# Altium schematic sheet 电路图.SchDoc
size A
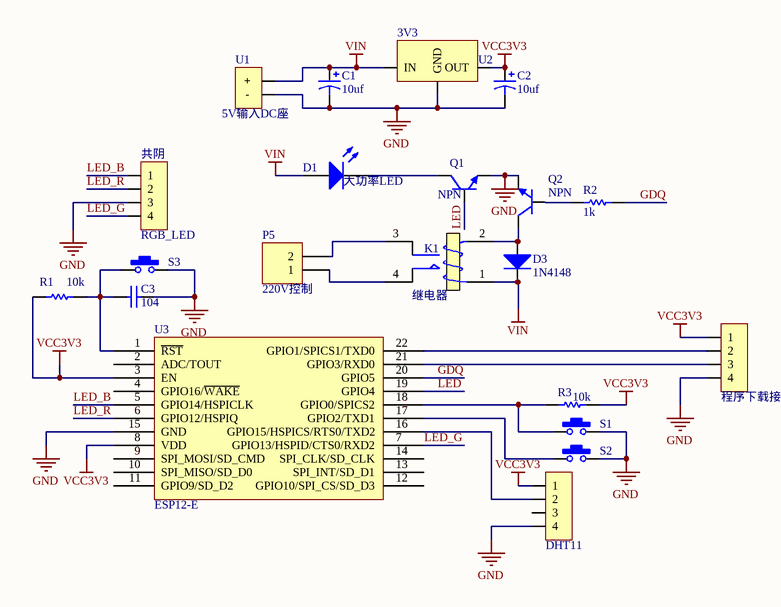
[diagram p0: 电路图.SchDoc]

## Parts
C1  CAP0  [3528 钽电容]  (value not drawn)
C2  CAP0  [3528 钽电容]  (value not drawn)
C3  104  [0805-0C]
D1  大功率LED  [3.5X2.8X1.9]
D3  1N4148  [二极管]
DHT11  下载接口  [XH2.54-4]  (value not drawn)
K1  继电器  [继电器]
P5  220V控制  [HDR1X2]
Q1  NPN  [SS8050]
Q2  NPN  [SS8050]
R1  RES  [0805-0R]  (value not drawn)
R2  RES  [0805-0R]  (value not drawn)
R3  RES  [0805-0R]  (value not drawn)
RGB_LED  共阴  [XH2.54-4]
S1  KEY  [KEY-DIP4]  (value not drawn)
S2  KEY  [KEY-DIP4]  (value not drawn)
S3  KEY  [KEY-DIP4]  (value not drawn)
U1  5V输入DC座  [DC-PJ044A]
U2  3V3  [SOT-223]
U3  ESP12-E  [ESP12-E]
程序下载接口  下载接口  [XH2.54-4]  (value not drawn)

## Nets
GND: C1.2 C2.2 C3.1 DHT11.4 Q1.E Q2.E RGB_LED.3 S1.2 S2.2 S3.2 U1.1(－) U2.1(GND) U3.15(GND) 程序下载接口.4
VCC3V3: C2.1 DHT11.1 R1.1 R3.1 U2.2(OUT) U3.3(EN) U3.8(VDD) 程序下载接口.1
VIN: C1.1 D1.1(A) D3.2(K) K1.1 U1.2(＋) U2.3(IN)
GDQ: R2.1 U3.20(GPIO5)
LED: Q1.B U3.19(GPIO4)
LED_B: RGB_LED.1 U3.5(GPIO14/HSPICLK)
LED_G: RGB_LED.4 U3.7(GPIO13/HSPID/CTS0/RXD2)
LED_R: RGB_LED.2 U3.6(GPIO12/HSPIQ)
NetC3_2: C3.2 R1.2 S3.1 U3.1(~{RST})
NetD1_2: D1.2(K) Q1.C
NetD3_1: D3.1(A) K1.2 Q2.C
NetDHT11_2: DHT11.2 U3.16(GPIO15/HSPICS/RTS0/TXD2)
NetK1_3: K1.3 P5.2
NetK1_4: K1.4 P5.1
NetQ2_B: Q2.B R2.2
NetR3_2: R3.2 S1.1 U3.18(GPIO0/SPICS2)
NetS2_1: S2.1 U3.17(GPIO2/TXD1)
NetU3_21: U3.21(GPIO3/RXD0) 程序下载接口.3
NetU3_22: U3.22(GPIO1/SPICS1/TXD0) 程序下载接口.2

Not connected (* = marked no-connect by the designer): DHT11 3; U3 2(ADC/TOUT) 4(GPIO16/~{WAKE}) 9(SPI_MOSI/SD_CMD) 10(SPI_MISO/SD_D0) 11(GPIO9/SD_D2) 12(GPIO10/SPI_CS/SD_D3) 13(SPI_INT/SD_D1) 14(SPI_CLK/SD_CLK)

## Notes on the sheet
- (in symbol CAP0) 10uf
- (in symbol RES) 1k; 10k

## Library data of the parts
C1 C2 = CAP0: 电解电容
C3 = CAP1: 无极电容
D1 = LED3: Typical BLUE SiC LED; Published: 8-Jun-2000; LatestRevisionDate: 17-Dec-2003; LatestRevisionNote: PCB Footprint replaced.; DatasheetVersion: 16-Apr-2002; PackageVersion: 16-Apr-2002; PackageReference: 3.5X2.8X1.9; Publisher: Altium Limited; PackageDescription: SM LED; 2 C-Bend Leads; Body 3.5 x 2.8 x 1.9 mm, inc leads (LxWxH typ)
D3 = 二极管
DHT11 RGB_LED 程序下载接口 = Header_4: 接线柱
P5 = Header 2: Header, 2-Pin; LatestRevisionDate: 17-Jul-2002; LatestRevisionNote: Re-released for DXP Platform.; Publisher: Altium Limited
Q1 Q2 = NPN: 9013、9014、8050
R1-R3 = RES: 电阻
S1-S3 = KEY: 微动开关
U1 = DC座: DC插座
U2 = ASM1117: 降压稳压器贴SOT223片封装
U3 = ESP12-E: ESP8266-E